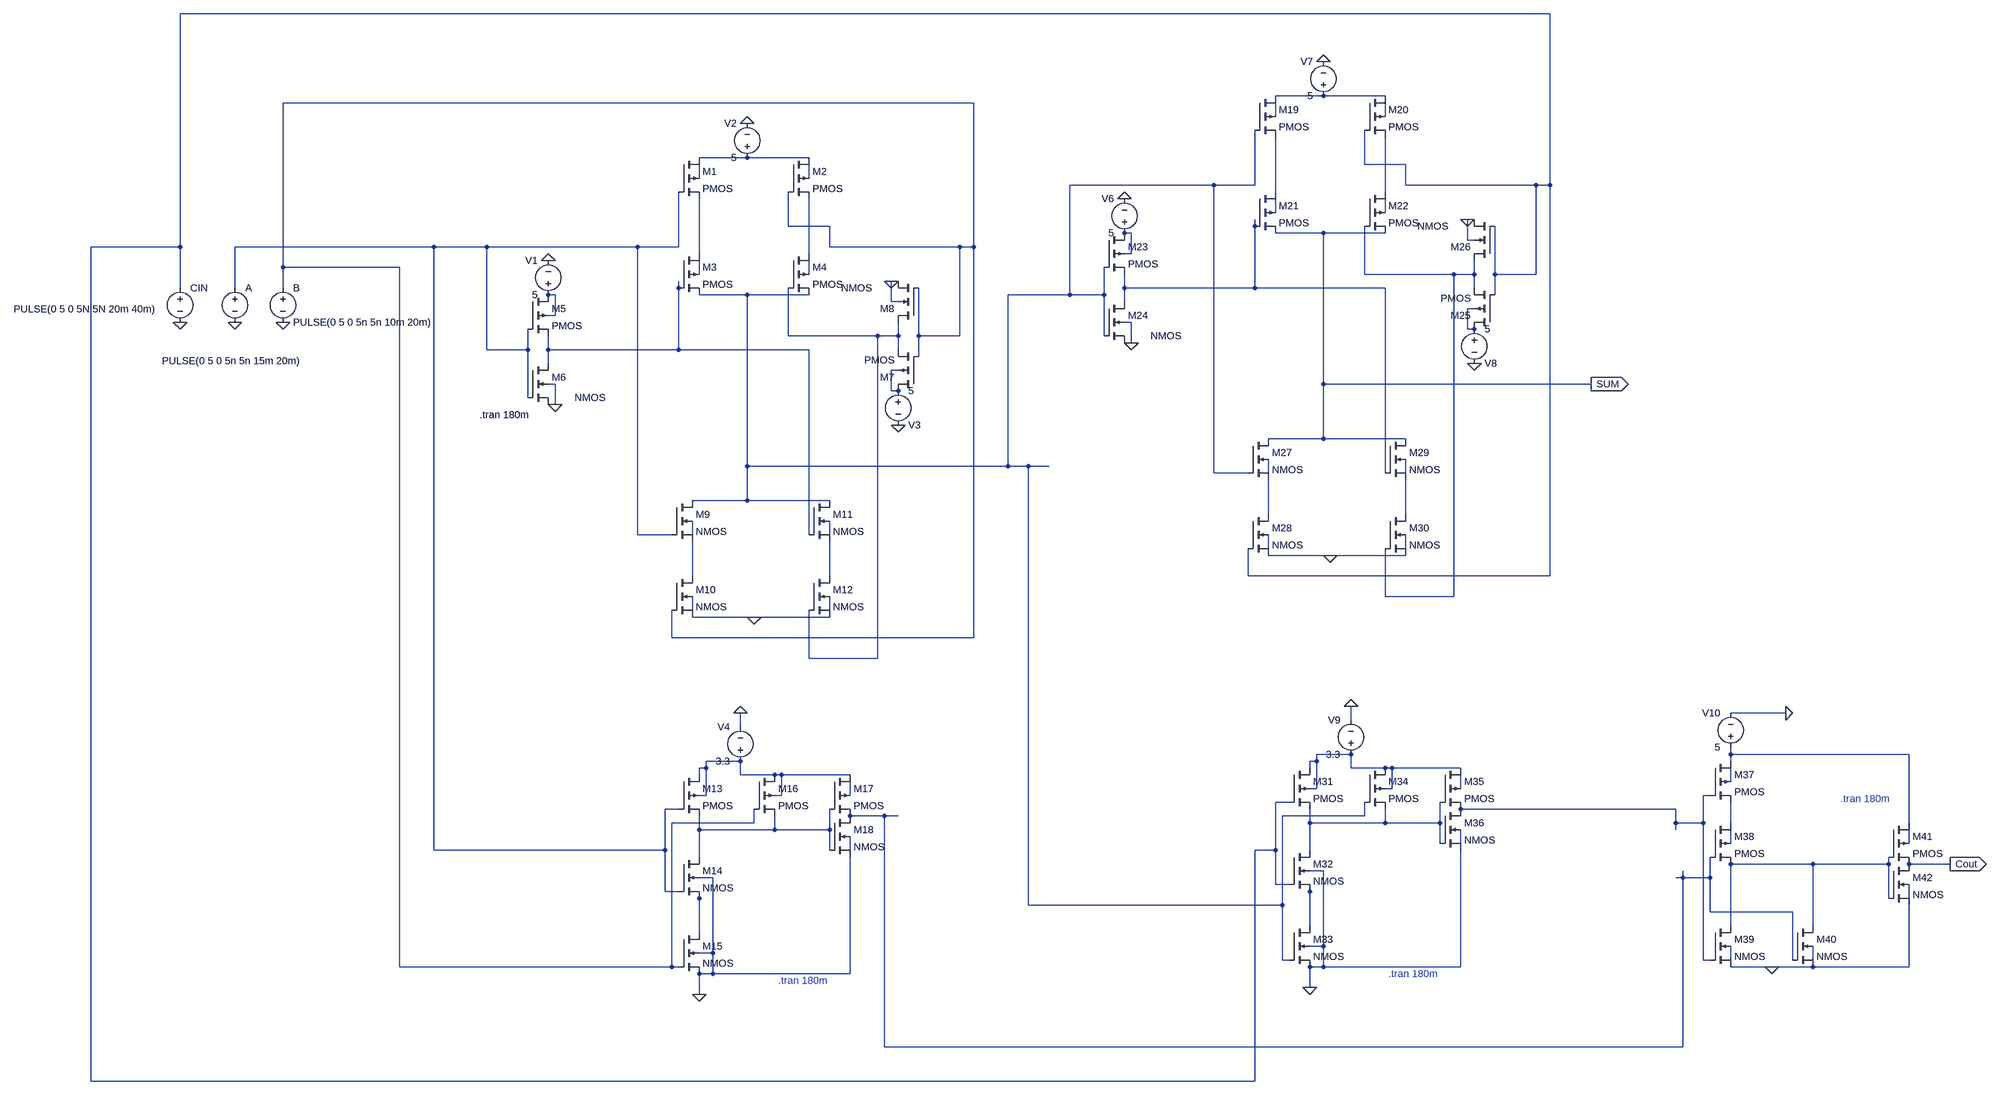
[diagram p0: schematic fulladder.asc]
fulladder.asc, the LTspice schematic file:
Version 4
SHEET 1 7120 2340
WIRE 5664 -160 2464 -160
WIRE 5136 32 5024 32
WIRE 5280 32 5136 32
WIRE 4320 48 2704 48
WIRE 5024 80 5024 48
WIRE 5280 80 5280 48
WIRE 3792 176 3680 176
WIRE 3936 176 3792 176
WIRE 5232 192 5232 112
WIRE 5328 192 5232 192
WIRE 3680 224 3680 192
WIRE 3936 224 3936 192
WIRE 4880 240 4544 240
WIRE 4976 240 4976 112
WIRE 4976 240 4880 240
WIRE 5328 240 5328 192
WIRE 5632 240 5328 240
WIRE 5664 240 5664 -160
WIRE 5664 240 5632 240
WIRE 5024 256 5024 128
WIRE 5280 256 5280 128
WIRE 5024 304 5024 272
WIRE 5280 304 5280 272
WIRE 5488 320 5472 320
WIRE 3888 336 3888 256
WIRE 3984 336 3888 336
WIRE 4976 336 4976 320
WIRE 4688 352 4672 352
WIRE 5136 352 5024 352
WIRE 5280 352 5136 352
WIRE 5472 368 5472 320
WIRE 5488 368 5472 368
WIRE 2464 384 2464 -160
WIRE 2464 384 2256 384
WIRE 3056 384 2592 384
WIRE 3184 384 3056 384
WIRE 3536 384 3184 384
WIRE 3632 384 3632 256
WIRE 3632 384 3536 384
WIRE 3984 384 3984 336
WIRE 4288 384 3984 384
WIRE 4320 384 4320 48
WIRE 4320 384 4288 384
WIRE 3680 400 3680 272
WIRE 3936 400 3936 272
WIRE 4688 400 4688 352
WIRE 4688 400 4672 400
WIRE 2704 432 2704 48
WIRE 2976 432 2704 432
WIRE 3680 448 3680 416
WIRE 3936 448 3936 416
WIRE 5232 448 5232 336
WIRE 5440 448 5232 448
WIRE 5488 448 5488 416
WIRE 5488 448 5440 448
WIRE 5536 448 5536 336
WIRE 5632 448 5632 240
WIRE 5632 448 5536 448
WIRE 4144 464 4128 464
WIRE 2464 480 2464 384
WIRE 2592 480 2592 384
WIRE 2704 480 2704 432
WIRE 3632 480 3632 464
WIRE 4672 480 4672 448
WIRE 4976 480 4976 336
WIRE 4976 480 4672 480
WIRE 5280 480 4976 480
WIRE 5488 480 5488 448
WIRE 3344 496 3328 496
WIRE 3792 496 3680 496
WIRE 3936 496 3792 496
WIRE 4544 496 4544 240
WIRE 4544 496 4400 496
WIRE 4624 496 4624 432
WIRE 4624 496 4544 496
WIRE 5536 496 5536 448
WIRE 4128 512 4128 464
WIRE 4144 512 4128 512
WIRE 4672 512 4672 480
WIRE 5488 528 5472 528
WIRE 3344 544 3344 496
WIRE 3344 544 3328 544
WIRE 4688 560 4672 560
WIRE 5472 576 5472 528
WIRE 5488 576 5472 576
WIRE 3888 592 3888 480
WIRE 4096 592 3888 592
WIRE 4144 592 4144 560
WIRE 4144 592 4096 592
WIRE 4192 592 4192 480
WIRE 4288 592 4288 384
WIRE 4288 592 4192 592
WIRE 4624 592 4624 496
WIRE 4688 608 4688 560
WIRE 4688 608 4672 608
WIRE 3184 624 3184 384
WIRE 3280 624 3280 576
WIRE 3280 624 3184 624
WIRE 3328 624 3328 592
WIRE 3632 624 3632 480
WIRE 3632 624 3328 624
WIRE 3936 624 3632 624
WIRE 4144 624 4144 592
WIRE 4192 640 4192 592
WIRE 3328 656 3328 624
WIRE 4144 672 4128 672
WIRE 3344 704 3328 704
WIRE 5136 704 5136 352
WIRE 5760 704 5136 704
WIRE 4128 720 4128 672
WIRE 4144 720 4128 720
WIRE 3280 736 3280 624
WIRE 3344 752 3344 704
WIRE 3344 752 3328 752
WIRE 5136 832 5136 704
WIRE 5136 832 5008 832
WIRE 5328 832 5136 832
WIRE 3792 896 3792 496
WIRE 4400 896 4400 496
WIRE 4400 896 3792 896
WIRE 4448 896 4400 896
WIRE 4496 896 4448 896
WIRE 4880 912 4880 240
WIRE 4960 912 4880 912
WIRE 5008 912 5008 880
WIRE 5280 912 5280 480
WIRE 5328 912 5328 880
WIRE 3792 976 3792 896
WIRE 3792 976 3664 976
WIRE 3984 976 3792 976
WIRE 5008 1008 5008 928
WIRE 5328 1008 5328 928
WIRE 3536 1056 3536 384
WIRE 3616 1056 3536 1056
WIRE 3664 1056 3664 1024
WIRE 3936 1056 3936 624
WIRE 3984 1056 3984 1024
WIRE 5008 1088 5008 1056
WIRE 5328 1088 5328 1056
WIRE 5152 1104 5008 1104
WIRE 5328 1104 5152 1104
WIRE 3664 1152 3664 1072
WIRE 3984 1152 3984 1072
WIRE 4960 1152 4960 1088
WIRE 5664 1152 5664 240
WIRE 5664 1152 4960 1152
WIRE 5280 1200 5280 1088
WIRE 5440 1200 5440 448
WIRE 5440 1200 5280 1200
WIRE 3664 1232 3664 1200
WIRE 3984 1232 3984 1200
WIRE 3808 1248 3664 1248
WIRE 3984 1248 3808 1248
WIRE 3616 1296 3616 1232
WIRE 4320 1296 4320 384
WIRE 4320 1296 3616 1296
WIRE 3936 1344 3936 1232
WIRE 4096 1344 4096 592
WIRE 4096 1344 3936 1344
WIRE 6624 1472 6496 1472
WIRE 5200 1488 5200 1456
WIRE 3776 1504 3776 1472
WIRE 5200 1568 5120 1568
WIRE 6496 1568 6496 1552
WIRE 6912 1568 6496 1568
WIRE 3776 1584 3696 1584
WIRE 5120 1584 5120 1568
WIRE 5120 1584 5104 1584
WIRE 6496 1584 6496 1568
WIRE 3696 1600 3696 1584
WIRE 3696 1600 3680 1600
WIRE 5104 1600 5104 1584
WIRE 5200 1600 5200 1568
WIRE 5280 1600 5200 1600
WIRE 5296 1600 5280 1600
WIRE 5456 1600 5296 1600
WIRE 3680 1616 3680 1600
WIRE 3776 1616 3776 1584
WIRE 3856 1616 3776 1616
WIRE 3872 1616 3856 1616
WIRE 4032 1616 3872 1616
WIRE 6496 1632 6496 1600
WIRE 5120 1648 5120 1584
WIRE 5120 1648 5104 1648
WIRE 5296 1648 5296 1600
WIRE 5296 1648 5280 1648
WIRE 5456 1648 5456 1616
WIRE 3696 1664 3696 1600
WIRE 3696 1664 3680 1664
WIRE 3872 1664 3872 1616
WIRE 3872 1664 3856 1664
WIRE 4032 1664 4032 1632
WIRE 6448 1664 6432 1664
WIRE 5056 1680 5024 1680
WIRE 3632 1696 3600 1696
WIRE 6368 1696 5456 1696
WIRE 4112 1712 4032 1712
WIRE 4144 1712 4112 1712
WIRE 5232 1712 5232 1680
WIRE 5232 1712 5040 1712
WIRE 3808 1728 3808 1696
WIRE 3808 1728 3616 1728
WIRE 5104 1728 5104 1696
WIRE 5280 1728 5280 1696
WIRE 5280 1728 5104 1728
WIRE 5408 1728 5408 1680
WIRE 5408 1728 5280 1728
WIRE 6368 1728 6368 1696
WIRE 6432 1728 6432 1664
WIRE 6432 1728 6368 1728
WIRE 6496 1728 6496 1680
WIRE 6912 1728 6912 1568
WIRE 3680 1744 3680 1712
WIRE 3856 1744 3856 1712
WIRE 3856 1744 3680 1744
WIRE 3984 1744 3984 1696
WIRE 3984 1744 3856 1744
WIRE 6368 1744 6368 1728
WIRE 5408 1776 5408 1728
WIRE 5456 1776 5456 1744
WIRE 6496 1776 6496 1744
WIRE 6912 1776 6912 1744
WIRE 3056 1792 3056 384
WIRE 3600 1792 3600 1696
WIRE 3600 1792 3056 1792
WIRE 3984 1792 3984 1744
WIRE 4032 1792 4032 1760
WIRE 5024 1792 5024 1680
WIRE 5024 1792 4976 1792
WIRE 5104 1792 5104 1728
WIRE 3680 1808 3680 1744
WIRE 6688 1824 6496 1824
WIRE 6864 1824 6864 1808
WIRE 6864 1824 6688 1824
WIRE 7008 1824 6912 1824
WIRE 5136 1840 5104 1840
WIRE 3712 1856 3680 1856
WIRE 6384 1856 6384 1840
WIRE 6384 1856 6368 1856
WIRE 6448 1856 6448 1808
WIRE 6448 1856 6384 1856
WIRE 5024 1872 5024 1792
WIRE 5056 1872 5024 1872
WIRE 3600 1888 3600 1792
WIRE 3632 1888 3600 1888
WIRE 5104 1888 5104 1872
WIRE 3680 1904 3680 1888
WIRE 6864 1904 6864 1824
WIRE 6912 1904 6912 1872
WIRE 4448 1920 4448 896
WIRE 5040 1920 5040 1712
WIRE 5040 1920 4448 1920
WIRE 6448 1936 6448 1856
WIRE 6640 1936 6448 1936
WIRE 5104 1968 5104 1888
WIRE 6496 1968 6496 1824
WIRE 6688 1968 6688 1824
WIRE 3680 1984 3680 1904
WIRE 5136 2016 5136 1840
WIRE 5136 2016 5104 2016
WIRE 3712 2032 3712 1856
WIRE 3712 2032 3680 2032
WIRE 5040 2048 5040 1920
WIRE 5056 2048 5040 2048
WIRE 6432 2048 6432 1728
WIRE 6448 2048 6432 2048
WIRE 6496 2048 6496 2016
WIRE 6640 2048 6640 1936
WIRE 6688 2048 6688 2016
WIRE 2976 2064 2976 432
WIRE 3616 2064 3616 1728
WIRE 3616 2064 2976 2064
WIRE 3632 2064 3616 2064
WIRE 5136 2064 5136 2016
WIRE 5136 2064 5104 2064
WIRE 5456 2064 5456 1792
WIRE 5456 2064 5136 2064
WIRE 6592 2064 6496 2064
WIRE 6688 2064 6592 2064
WIRE 6912 2064 6912 1920
WIRE 6912 2064 6688 2064
WIRE 3712 2080 3712 2032
WIRE 3712 2080 3680 2080
WIRE 4032 2080 4032 1808
WIRE 4032 2080 3712 2080
WIRE 5104 2112 5104 2064
WIRE 3680 2128 3680 2080
WIRE 4112 2256 4112 1712
WIRE 6384 2256 6384 1856
WIRE 6384 2256 4112 2256
WIRE 2256 2336 2256 384
WIRE 4976 2336 4976 1792
WIRE 4976 2336 2256 2336
FLAG 3344 752 0
FLAG 3328 416 0
FLAG 3792 96 0
FLAG 4128 464 0
FLAG 4144 800 0
FLAG 3808 1248 0
FLAG 3680 2128 0
FLAG 3776 1472 0
FLAG 4688 608 0
FLAG 4672 272 0
FLAG 5136 -48 0
FLAG 5472 320 0
FLAG 5488 656 0
FLAG 5152 1104 0
FLAG 5104 2112 0
FLAG 5200 1456 0
FLAG 6624 1472 0
FLAG 6592 2064 0
FLAG 7008 1824 Cout
IOPIN 7008 1824 Out
FLAG 5760 704 SUM
IOPIN 5760 704 Out
FLAG 2464 560 0
FLAG 2592 560 0
FLAG 2704 560 0
SYMBOL pmos4 3632 176 R0
SYMATTR InstName M1
SYMBOL pmos4 3888 176 R0
SYMATTR InstName M2
SYMBOL pmos4 3632 400 R0
SYMATTR InstName M3
SYMBOL pmos4 3888 400 R0
SYMATTR InstName M4
SYMBOL pmos4 3280 496 R0
SYMATTR InstName M5
SYMBOL nmos4 3280 656 R0
WINDOW 3 109 80 Left 2
SYMATTR InstName M6
SYMBOL voltage 3328 512 R180
WINDOW 0 24 96 Left 2
WINDOW 3 24 16 Left 2
WINDOW 123 0 0 Left 0
WINDOW 39 0 0 Left 0
SYMATTR InstName V1
SYMATTR Value 5
SYMBOL voltage 3792 192 R180
WINDOW 0 24 96 Left 2
WINDOW 3 24 16 Left 2
WINDOW 123 0 0 Left 0
WINDOW 39 0 0 Left 0
SYMATTR InstName V2
SYMATTR Value 5
SYMBOL pmos4 4192 720 R180
SYMATTR InstName M7
SYMBOL nmos4 4192 560 R180
WINDOW 3 109 80 Left 2
SYMATTR InstName M8
SYMBOL voltage 4144 704 R0
WINDOW 0 24 96 Left 2
WINDOW 3 24 16 Left 2
WINDOW 123 0 0 Left 0
WINDOW 39 0 0 Left 0
SYMATTR InstName V3
SYMATTR Value 5
SYMBOL nmos4 3616 976 R0
SYMATTR InstName M9
SYMBOL nmos4 3616 1152 R0
SYMATTR InstName M10
SYMBOL nmos4 3936 976 R0
SYMATTR InstName M11
SYMBOL nmos4 3936 1152 R0
SYMATTR InstName M12
SYMBOL pmos4 3632 1616 R0
SYMATTR InstName M13
SYMATTR Value2 l=1040nm w=1040nm
SYMBOL nmos4 3632 1808 R0
SYMATTR InstName M14
SYMATTR Value2 l=1040nm w=1040nm
SYMBOL nmos4 3632 1984 R0
SYMATTR InstName M15
SYMATTR Value2 l=1040nm w=1040nm
SYMBOL voltage 3776 1600 R180
WINDOW 0 24 96 Left 2
WINDOW 3 24 16 Left 2
WINDOW 123 0 0 Left 0
WINDOW 39 0 0 Left 0
SYMATTR InstName V4
SYMATTR Value 3.3
SYMBOL pmos4 3808 1616 R0
SYMATTR InstName M16
SYMBOL pmos4 3984 1616 R0
SYMATTR InstName M17
SYMBOL nmos4 3984 1712 R0
SYMATTR InstName M18
SYMBOL pmos4 4976 32 R0
SYMATTR InstName M19
SYMBOL pmos4 5232 32 R0
SYMATTR InstName M20
SYMBOL pmos4 4976 256 R0
SYMATTR InstName M21
SYMBOL pmos4 5232 256 R0
SYMATTR InstName M22
SYMBOL pmos4 4624 352 R0
SYMATTR InstName M23
SYMBOL nmos4 4624 512 R0
WINDOW 3 109 80 Left 2
SYMATTR InstName M24
SYMBOL voltage 4672 368 R180
WINDOW 0 24 96 Left 2
WINDOW 3 24 16 Left 2
WINDOW 123 0 0 Left 0
WINDOW 39 0 0 Left 0
SYMATTR InstName V6
SYMATTR Value 5
SYMBOL voltage 5136 48 R180
WINDOW 0 24 96 Left 2
WINDOW 3 24 16 Left 2
WINDOW 123 0 0 Left 0
WINDOW 39 0 0 Left 0
SYMATTR InstName V7
SYMATTR Value 5
SYMBOL pmos4 5536 576 R180
SYMATTR InstName M25
SYMBOL nmos4 5536 416 R180
WINDOW 3 109 80 Left 2
SYMATTR InstName M26
SYMBOL voltage 5488 560 R0
WINDOW 0 24 96 Left 2
WINDOW 3 24 16 Left 2
WINDOW 123 0 0 Left 0
WINDOW 39 0 0 Left 0
SYMATTR InstName V8
SYMATTR Value 5
SYMBOL nmos4 4960 832 R0
SYMATTR InstName M27
SYMBOL nmos4 4960 1008 R0
SYMATTR InstName M28
SYMBOL nmos4 5280 832 R0
SYMATTR InstName M29
SYMBOL nmos4 5280 1008 R0
SYMATTR InstName M30
SYMBOL pmos4 5056 1600 R0
SYMATTR InstName M31
SYMATTR Value2 l=1040nm w=1040nm
SYMBOL nmos4 5056 1792 R0
SYMATTR InstName M32
SYMATTR Value2 l=1040nm w=1040nm
SYMBOL nmos4 5056 1968 R0
SYMATTR InstName M33
SYMATTR Value2 l=1040nm w=1040nm
SYMBOL voltage 5200 1584 R180
WINDOW 0 24 96 Left 2
WINDOW 3 24 16 Left 2
WINDOW 123 0 0 Left 0
WINDOW 39 0 0 Left 0
SYMATTR InstName V9
SYMATTR Value 3.3
SYMBOL pmos4 5232 1600 R0
SYMATTR InstName M34
SYMBOL pmos4 5408 1600 R0
SYMATTR InstName M35
SYMBOL nmos4 5408 1696 R0
SYMATTR InstName M36
SYMBOL pmos4 6448 1584 R0
SYMATTR InstName M37
SYMBOL pmos4 6448 1728 R0
SYMATTR InstName M38
SYMBOL nmos4 6448 1968 R0
SYMATTR InstName M39
SYMBOL nmos4 6640 1968 R0
SYMATTR InstName M40
SYMBOL voltage 6496 1568 R180
WINDOW 0 24 96 Left 2
WINDOW 3 24 16 Left 2
WINDOW 123 0 0 Left 0
WINDOW 39 0 0 Left 0
SYMATTR InstName V10
SYMATTR Value 5
SYMBOL pmos4 6864 1728 R0
SYMATTR InstName M41
SYMBOL nmos4 6864 1824 R0
SYMATTR InstName M42
SYMBOL voltage 2592 464 R0
WINDOW 3 -170 186 Left 2
WINDOW 123 0 0 Left 0
WINDOW 39 0 0 Left 0
SYMATTR InstName A
SYMATTR Value PULSE(0 5 0 5n 5n 15m 20m)
SYMBOL voltage 2704 464 R0
WINDOW 123 0 0 Left 0
WINDOW 39 0 0 Left 0
SYMATTR InstName B
SYMATTR Value PULSE(0 5 0 5n 5n 10m 20m)
SYMBOL voltage 2464 464 R0
WINDOW 3 -388 65 Left 2
WINDOW 123 0 0 Left 0
WINDOW 39 0 0 Left 0
SYMATTR InstName CIN
SYMATTR Value PULSE(0 5 0 5N 5N 20m 40m)
TEXT 3168 776 Left 2 !.tran 180m
TEXT 3864 2096 Left 2 ;.tran 180m
TEXT 5288 2080 Left 2 ;.tran 180m
TEXT 6752 1672 Left 2 ;.tran 180m

The netlist it stands for:
* fulladder.asc
M1 N006 N016 N017 N007 PMOS
M2 N006 N003 N018 N008 PMOS
M3 N017 N022 N009 N019 PMOS
M4 N018 N025 N009 N020 PMOS
M5 N023 N016 N022 N023 PMOS
M6 N022 N016 0 0 NMOS
V1 N023 0 5
V2 N006 0 5
M7 N026 N003 N025 N026 PMOS
M8 N025 N003 0 0 NMOS
V3 N026 0 5
M9 N009 N016 N035 N031 NMOS
M10 N035 N003 0 N037 NMOS
M11 N009 N022 N036 N032 NMOS
M12 N036 N025 0 N038 NMOS
M13 N041 N016 N049 N041 PMOS l=1040nm w=1040nm
M14 N049 N016 N056 0 NMOS l=1040nm w=1040nm
M15 N056 N003 0 0 NMOS l=1040nm w=1040nm
V4 N041 0 3.3
M16 N041 N003 N049 N041 PMOS
M17 N041 N049 N046 N044 PMOS
M18 N046 N049 0 N053 NMOS
M19 N002 N009 N010 N004 PMOS
M20 N002 N001 N011 N005 PMOS
M21 N010 N014 SUM N012 PMOS
M22 N011 N021 SUM N013 PMOS
M23 N015 N009 N014 N015 PMOS
M24 N014 N009 0 0 NMOS
V6 N015 0 5
V7 N002 0 5
M25 N024 N001 N021 N024 PMOS
M26 N021 N001 0 0 NMOS
V8 N024 0 5
M27 SUM N009 N029 N027 NMOS
M28 N029 N001 0 N033 NMOS
M29 SUM N014 N030 N028 NMOS
M30 N030 N021 0 N034 NMOS
M31 N039 N001 N047 N039 PMOS l=1040nm w=1040nm
M32 N047 N001 N055 0 NMOS l=1040nm w=1040nm
M33 N055 N009 0 0 NMOS l=1040nm w=1040nm
V9 N039 0 3.3
M34 N039 N009 N047 N039 PMOS
M35 N039 N047 N045 N043 PMOS
M36 N045 N047 0 N050 NMOS
M37 N040 N045 N048 N042 PMOS
M38 N048 N046 N054 N051 PMOS
M39 N054 N045 0 N058 NMOS
M40 N054 N046 0 N059 NMOS
V10 N040 0 5
M41 N040 N054 Cout N052 PMOS
M42 Cout N054 0 N057 NMOS
V§A N016 0 PULSE(0 5 0 5n 5n 15m 20m)
V§B N003 0 PULSE(0 5 0 5n 5n 10m 20m)
V§CIN N001 0 PULSE(0 5 0 5N 5N 20m 40m)
.model NMOS NMOS
.model PMOS PMOS
.lib standard.mos
.tran 180m
* .tran 180m
* .tran 180m
* .tran 180m
.backanno
.end